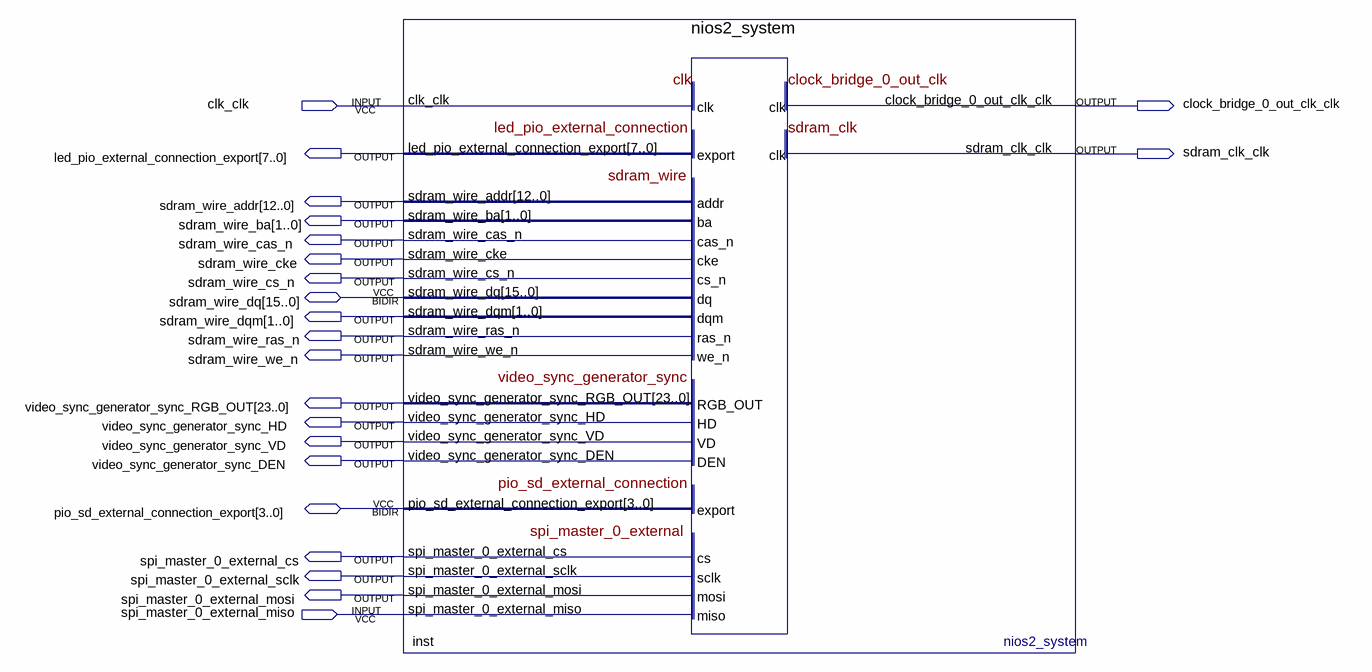
[diagram p0: schematic sheet]
// Quartus schematic DE0-Nano_LCD.bdf as structural Verilog: 1 symbols, 22 pins
module \DE0-Nano_LCD  (
  input  clk_clk,
  input  spi_master_0_external_miso,
  inout  [15:0] sdram_wire_dq,
  inout  [3:0] pio_sd_external_connection_export,
  output clock_bridge_0_out_clk_clk,
  output [7:0] led_pio_external_connection_export,
  output sdram_clk_clk,
  output [12:0] sdram_wire_addr,
  output [1:0] sdram_wire_ba,
  output sdram_wire_cas_n,
  output sdram_wire_cke,
  output sdram_wire_cs_n,
  output [1:0] sdram_wire_dqm,
  output sdram_wire_ras_n,
  output sdram_wire_we_n,
  output [23:0] video_sync_generator_sync_RGB_OUT,
  output video_sync_generator_sync_HD,
  output video_sync_generator_sync_VD,
  output video_sync_generator_sync_DEN,
  output spi_master_0_external_cs,
  output spi_master_0_external_sclk,
  output spi_master_0_external_mosi
);

  nios2_system inst (
    .clk_clk(clk_clk), .spi_master_0_external_miso(spi_master_0_external_miso),
    .led_pio_external_connection_export(led_pio_external_connection_export),
    .sdram_wire_addr(sdram_wire_addr), .sdram_wire_ba(sdram_wire_ba), .sdram_wire_cas_n(sdram_wire_cas_n),
    .sdram_wire_cke(sdram_wire_cke), .sdram_wire_cs_n(sdram_wire_cs_n), .sdram_wire_dqm(sdram_wire_dqm),
    .sdram_wire_ras_n(sdram_wire_ras_n), .sdram_wire_we_n(sdram_wire_we_n),
    .video_sync_generator_sync_RGB_OUT(video_sync_generator_sync_RGB_OUT),
    .video_sync_generator_sync_HD(video_sync_generator_sync_HD),
    .video_sync_generator_sync_VD(video_sync_generator_sync_VD),
    .video_sync_generator_sync_DEN(video_sync_generator_sync_DEN),
    .clock_bridge_0_out_clk_clk(clock_bridge_0_out_clk_clk), .sdram_clk_clk(sdram_clk_clk),
    .spi_master_0_external_cs(spi_master_0_external_cs),
    .spi_master_0_external_sclk(spi_master_0_external_sclk),
    .spi_master_0_external_mosi(spi_master_0_external_mosi), .sdram_wire_dq(sdram_wire_dq),
    .pio_sd_external_connection_export(pio_sd_external_connection_export));
endmodule
